# EAGLE design schematic (EAGLE 7.7.0)
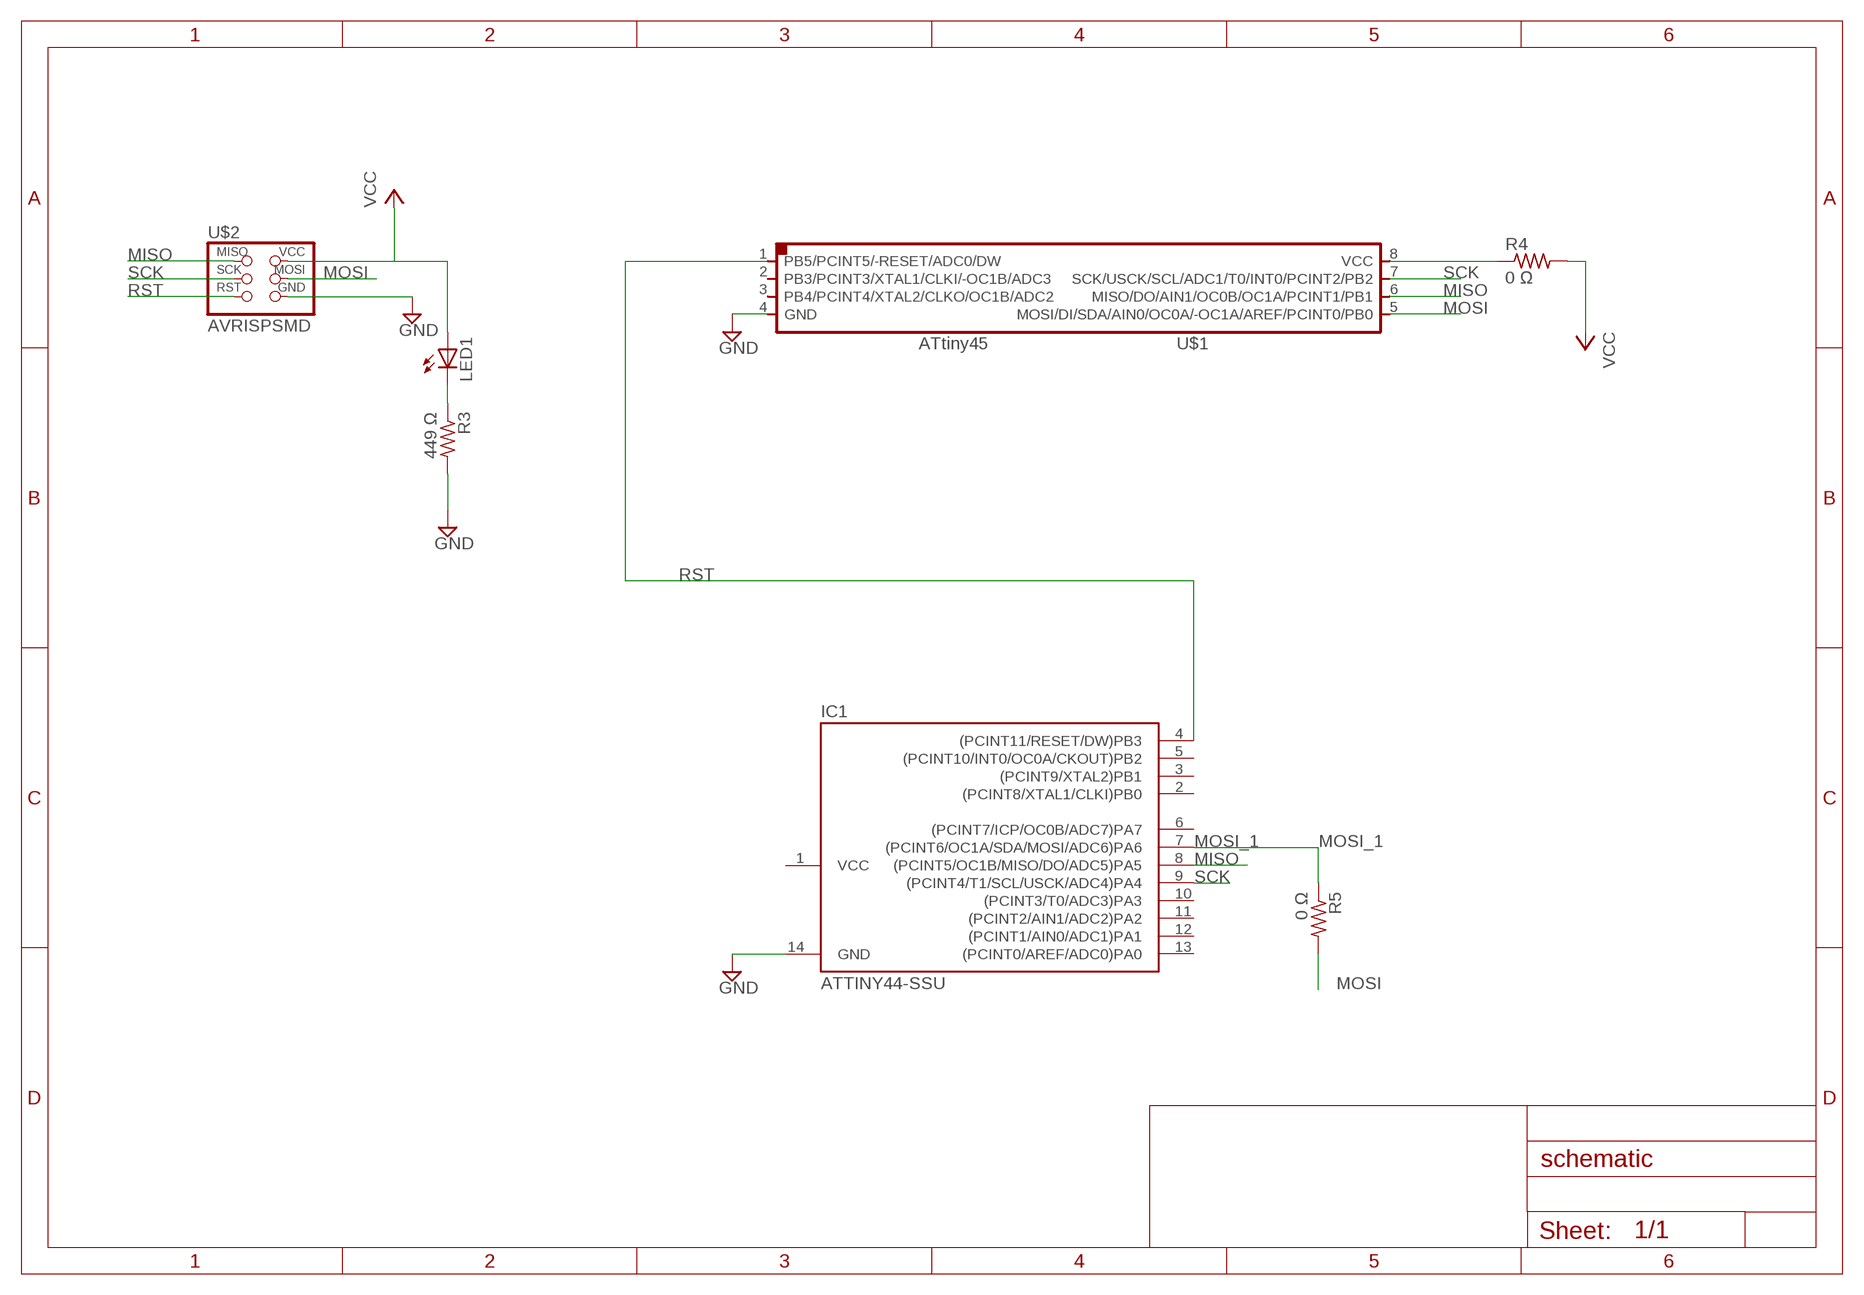
[diagram p0: schematic, sheet 1]

## Parts
IC1  ATTINY44-SSU  [SOIC14]
LED1  LEDCHIPLED_1206  [CHIPLED_1206]
R3  449 Ω  RES-US1206  [R1206]
R4  0 Ω  RES-US1206  [R1206]
R5  0 Ω  RES-US1206  [R1206]
U$1  ATTINY45SI  [SOIC8]
U$2  AVRISPSMD  [2X03SMD]

## Nets
GND: IC1.14(GND) R3.2 U$1.4(GND) U$2.6(GND)
MISO: IC1.8((PCINT5/OC1B/MISO/DO/ADC5)PA5) U$1.6(MISO/DO/AIN1/OC0B/OC1A/PCINT1/PB1) U$2.1(MISO)
MOSI: R5.2 U$1.5(MOSI/DI/SDA/AIN0/OC0A/-OC1A/AREF/PCINT0/PB0) U$2.4(MOSI)
MOSI_1: IC1.7((PCINT6/OC1A/SDA/MOSI/ADC6)PA6) R5.1
N$1: R4.1 U$1.8(VCC)
N$3: LED1.C R3.1
RST: IC1.4((PCINT11/RESET/DW)PB3) U$1.1(PB5/PCINT5/-RESET/ADC0/DW) U$2.5(RST)
SCK: IC1.9((PCINT4/T1/SCL/USCK/ADC4)PA4) U$1.7(SCK/USCK/SCL/ADC1/T0/INT0/PCINT2/PB2) U$2.3(SCK)
VCC: LED1.A R4.2 U$2.2(VCC)
Unconnected: IC1.2((PCINT8/XTAL1/CLKI)PB0) IC1.3((PCINT9/XTAL2)PB1) IC1.5((PCINT10/INT0/OC0A/CKOUT)PB2) IC1.6((PCINT7/ICP/OC0B/ADC7)PA7) IC1.10((PCINT3/T0/ADC3)PA3) IC1.11((PCINT2/AIN1/ADC2)PA2) IC1.12((PCINT1/AIN0/ADC1)PA1) IC1.13((PCINT0/AREF/ADC0)PA0) U$1.2(PB3/PCINT3/XTAL1/CLKI/-OC1B/ADC3) U$1.3(PB4/PCINT4/XTAL2/CLKO/OC1B/ADC2)

## Power pins joined to a net without a drawn wire
VCC: IC1.1(VCC)

## Library data of the parts
IC1 = fab:ATTINY44
LED1 = adafruit:LED: LED OSRAM: - CHIPLED LG R971, LG N971, LY N971, LG Q971, LY Q971, LO R971, LY R971 LH N974, LH R974 LS Q976, LO Q976, LY Q976 LO Q996 - Hyper CHIPLED LW Q18S LB Q993, LB Q99A, LB R99A - SideLED LS A670, LO A670, LY A670, LG A670, LP A670 LB A673, LV A673, LT A673, LW A673 LH A674 LY A675 LS A676, LA A676, LO A676, LY A676, LW A676 LS A679, LY A679, LG A679 - Hyper Micro SIDELED® LS Y876, LA Y876, LO Y876, LY Y876 LT Y87S - SmartLED LW L88C, LW L88S LB L89C, LB L89S, LG L890 LS L89K, LO L89K, LY L89K LS L896, LA L896, LO L896, LY L896 - TOPLED LS T670, LO T670, LY T670, LG T670, LP T670 LSG T670, LSP T670, LSY T670, LOP T670, LYG T670 LG T671, LOG T671, LSG T671 LB T673, LV T673, LT T673, LW T673 LH T674 LS T676, LA T676, LO T676, LY T676, LB T676, LH T676, LSB T676, LW T676 LB T67C, LV T67C, LT T67C, LS T67K, LO T67K, LY T67K, LW E67C LS E67B, LA E67B, LO E67B, LY E67B, LB E67C, LV E67C, LT E67C LW T67C LS T679, LY T679, LG T679 LS T770, LO T770, LY T770, LG T770, LP T770 LB T773, LV T773, LT T773, LW T773 LH T774 LS E675, LA E675, LY E675, LS T675 LS T776, LA T776, LO T776, LY T776, LB T776 LHGB T686 LT T68C, LB T68C - Hyper Mini TOPLED® LB M676 - Mini TOPLED Santana® LG M470 LS M47K, LO M47K, LY M47K Source: http://www.osram.convergy.de/
R3-R5 = fab:RES-US: Resistor (US Symbol) Variants with postfix FAB are widened to allow the routing of internal traces
U$1 = fab:ATTINY45
U$2 = fab:AVRISP

## Board
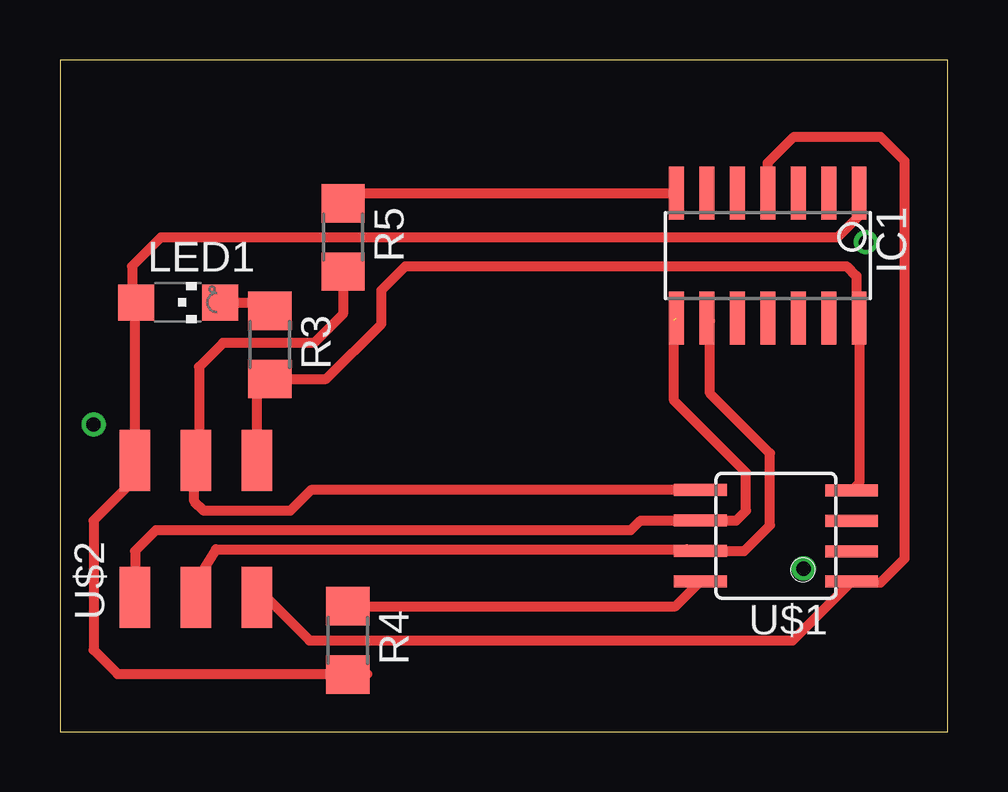
[diagram p1: board, top side]

Size 37 x 28 mm. Coordinates in mm from the lower left corner, seen from the top.
Outline: 0,0 37,0 37,28 0,28 0,0
Copper layers (1*16): Top 0.035mm / dielectric 1.5mm / Bottom 0.035mm
Design rules "default": minimum track width 10mil, minimum drill 24mil, track to track 8mil, track to pad 8mil, pad to pad 8mil, via to via 8mil, smd to smd 8mil, copper to edge 40mil, drill to drill 8mil, minimum pad ring 10mil, minimum via ring 8mil, stop-mask expansion 4mil, vias tented up to drill 0mil, thermal gap 10mil

### Footprints (pad centres in the part's own frame; a part is rotated, then mirrored left to right if it is on the bottom)
SOIC14 = smd 0.61 x 2.21: 1 -3.81,-2.603; 2 -2.54,-2.603; 3 -1.27,-2.603; 4 0,-2.603; 5 1.27,-2.603; 6 2.54,-2.603; 7 3.81,-2.603; 8 3.81,2.603; 9 2.54,2.603; 10 1.27,2.603; 11 0,2.603; 12 -1.27,2.603; 13 -2.54,2.603; 14 -3.81,2.603
CHIPLED_1206 = smd 1.5 x 1.5: A 0,-1.75; C 0,1.75
R1206 = smd 1.6 x 1.803: 1 -1.422,0; 2 1.422,0
SOIC8 = smd 0.5 x 2.2: 1 -1.905,-3.154; 2 -0.645,-3.154; 3 0.625,-3.154; 4 1.895,-3.154; 5 1.905,3.154; 6 0.635,3.154; 7 -0.635,3.154; 8 -1.905,3.154
2X03SMD = smd 2.54 x 1.27: 1 -2.857,2.54; 2 2.857,2.54; 3 -2.857,0; 4 2.857,0; 5 -2.857,-2.54; 6 2.857,-2.54

### Placement (x,y rotation side)
IC1  29.51,19.85 180 top
LED1  4.92,17.89 270 top
R3  8.75,16.12 270 top
R4  12,3.8 270 top
R5  11.8,20.6 270 top
U$1  29.85,8.16 90 top
U$2  5.67,8.45 90 top

### Tracks (layer width: path | path; a pad name or v marks a point on that pad's centre or on a via)
GND
  Top 0.406: U$2.6 8.21,14.16 R3.2 11.1,14.7 13.4,17 13.4,18.4 14.4,19.4 32.8,19.4 33.2,19 33.2,17.37 IC1.14 33.32,10.37 U$1.4
MISO  (1 unrouted)
  Top 0.406: U$2.1 3.13,7.53 4,8.4 23.8,8.4 24.2,8.8 U$1.6 28.2,8.79 28.6,9.2 28.6,10.8 25.6,13.8 25.6,17.15
MOSI
  Top 0.406: U$1.5 10.46,10.06 9.6,9.2 6,9.2 5.6,9.6 5.6,11.4 | 5.6,11.4 5.6,11.6 5.8,11.8 | R5.2 11.8,17.4 10.6,16.2 6.8,16.2 5.8,15.2 5.8,11.6 | 5.8,11.6 5.8,11.44 | U$2.4 5.67,11.47 | 5.67,11.47 5.8,11.6 | 5.67,11.47 5.6,11.4
MOSI_1
  Top 0.406: R5.1 12.23,22.45 IC1.7
N$1
  Top 0.406: R4.1 25.66,5.22 U$1.8
N$2  (via drill 0.6)
  other vias: 1.4,12.8 31,6.8 33.6,20.4
N$3
  Top 0.406: LED1.C 8.4,17.89 R3.1
RST
  Top 0.406: U$2.5 8.61,5.59 10.4,3.8 30.55,3.8 U$1.1 33.06,6.2 34.2,6.2 35.2,7.2 35.2,23.8 34.2,24.8 30.6,24.8 29.51,23.71 IC1.4
SCK
  Top 0.406: IC1.9 27.1,17.12 27.1,14.1 29.6,11.6 29.6,8.6 28.52,7.53 U$1.7 26.12,7.6 6.5,7.6 5.67,6.27 5.8,6.14 5.8,5.4 5.67,5.53 U$2.3
VCC
  Top 0.406: 12.02,2.4 2.4,2.4 1.4,3.4 1.4,8.8 3.13,10.53 U$2.2 3.13,17.85 LED1.A 3,18.06 3,19.4 4.2,20.6 32.4,20.6 33.32,21.52 IC1.1 | 12.82,2.4 12.02,2.4 | 12.02,2.4 R4.2